# EAGLE schematic Micro controller Board AS-2 (EAGLE 9.6.2)
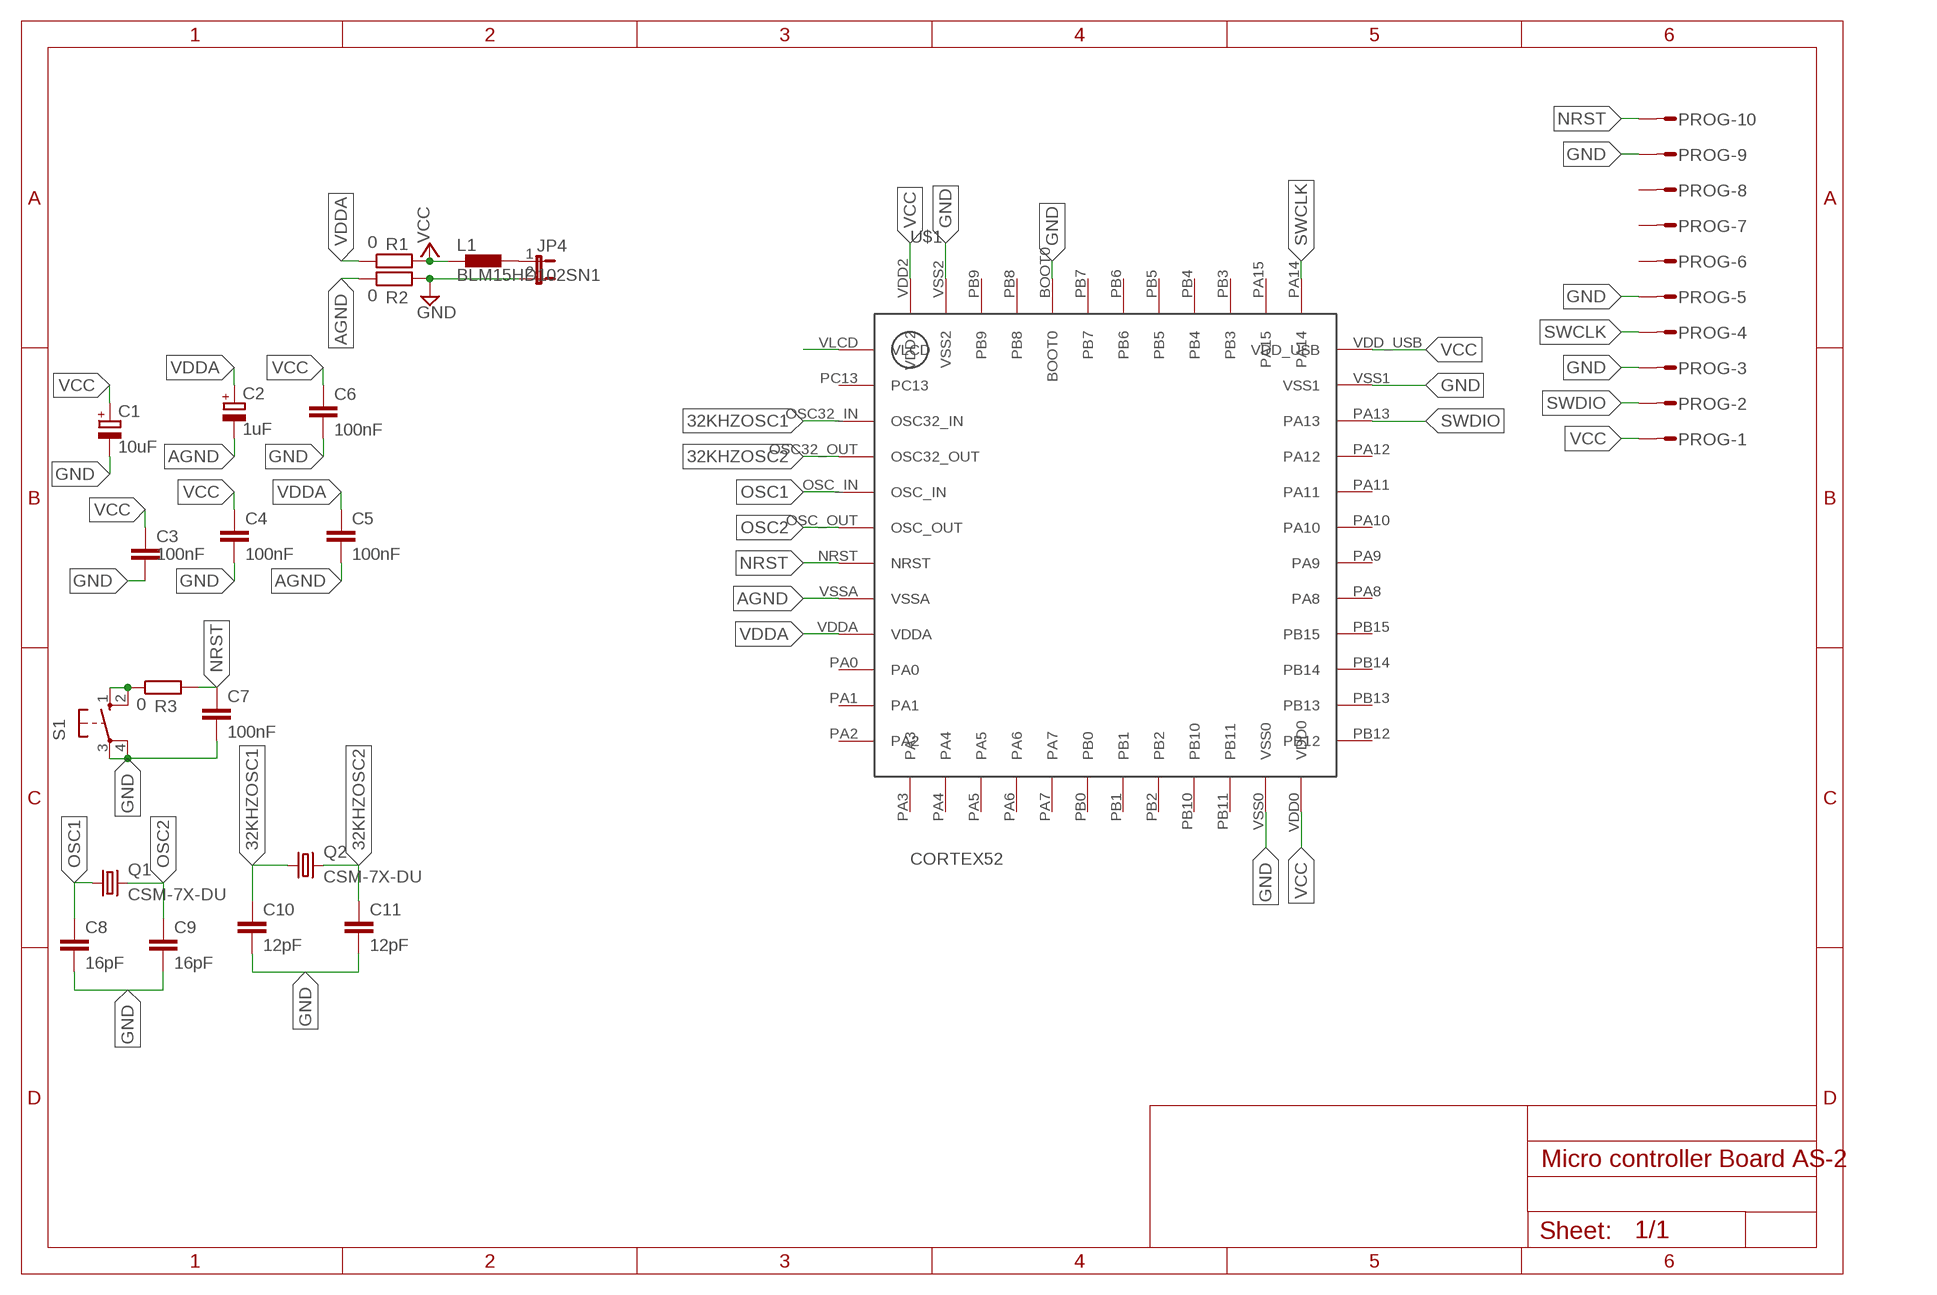
[diagram p0: schematic, sheet 1]

## Parts
C1  10uF  CPOL-EU139CLL-2R  [139CLL-2R]
C2  1uF  CPOL-EU139CLL-2R  [139CLL-2R]
C3  100nF  C-EUC0805  [C0805]
C4  100nF  C-EUC0805  [C0805]
C5  100nF  C-EUC0805  [C0805]
C6  100nF  C-EUC0805  [C0805]
C7  100nF  C-EUC0805  [C0805]
C8  16pF  C-EUC0805  [C0805]
C9  16pF  C-EUC0805  [C0805]
C10  12pF  C-EUC0805  [C0805]
C11  12pF  C-EUC0805  [C0805]
JP4  JP1E  [JP1]
L1  BLM15HD102SN1  [0402]
PROG  S10P  [S10P]
Q1  CSM-7X-DU  [CSM-7X-DU]
Q2  CSM-7X-DU  [CSM-7X-DU]
R1  0  R-EU_R0805  [R0805]
R2  0  R-EU_R0805  [R0805]
R3  0  R-EU_R0805  [R0805]
S1  10-XX  [B3F-10XX]
U$1  CORTEX52  [CORTEX52]

## Nets
32KHZOSC1: C10.1 Q2.1 U$1.OSC32_IN
32KHZOSC2: C11.1 Q2.2 U$1.OSC32_OUT
AGND: C2.- C5.2 R2.1 U$1.VSSA
GND: C1.- C3.2 C4.2 C6.2 C7.2 C8.2 C9.2 C10.2 C11.2 JP4.2 PROG.3 PROG.5 PROG.9 R2.2 S1.3(P) S1.4(P1) U$1.BOOT0 U$1.VSS0 U$1.VSS1 U$1.VSS2
N$1: JP4.1 L1.2
N$2: R3.1 S1.1(S) S1.2(S1)
N$5: U$1.VLCD
NRST: C7.1 PROG.10 R3.2 U$1.NRST
OSC1: C8.1 Q1.1 U$1.OSC_IN
OSC2: C9.1 Q1.2 U$1.OSC_OUT
SWCLK: PROG.4 U$1.PA14
SWDIO: PROG.2 U$1.PA13
VCC: C1.+ C3.1 C4.1 C6.1 L1.1 PROG.1 R1.2 U$1.VDD0 U$1.VDD2 U$1.VDD_USB
VDDA: C2.+ C5.1 R1.1 U$1.VDDA
Unconnected: PROG.6 PROG.7 PROG.8 U$1.PA0 U$1.PA1 U$1.PA2 U$1.PA3 U$1.PA4 U$1.PA5 U$1.PA6 U$1.PA7 U$1.PA8 U$1.PA9 U$1.PA10 U$1.PA11 U$1.PA12 U$1.PA15 U$1.PB0 U$1.PB1 U$1.PB2 U$1.PB3 U$1.PB4 U$1.PB5 U$1.PB6 U$1.PB7 U$1.PB8 U$1.PB9 U$1.PB10 U$1.PB11 U$1.PB12 U$1.PB13 U$1.PB14 U$1.PB15 U$1.PC13

## Library data of the parts
C1 C2 = rcl:CPOL-EU: POLARIZED CAPACITOR, European symbol; SPICEPREFIX: C
C3-C11 = rcl:C-EU: CAPACITOR, European symbol; SPICEPREFIX: C
JP4 = jumper:JP1E: JUMPER
L1 = inductors:BLM15H: EMIFIL (R) Chip Ferrite Bead for GHz Noise Source: http://www.murata.com/ Ferrite Bead BLM15H.pdf
PROG = con-amp-mt:S10P: AMP MT CONNECTOR; OC_FARNELL: unknown; OC_NEWARK: unknown
Q1 Q2 = crystal:CSM-7X-DU: SMD CRYSTAL Source: www.ecsxtal.com .. Crystal 3.6864MHz CSM_7X_DU.PDF; OC_FARNELL: unknown; OC_NEWARK: unknown
R1-R3 = rcl:R-EU_: RESISTOR, European symbol; SPICEPREFIX: R
S1 = switch-omron:10-XX: OMRON SWITCH; MPN: B3F-1000; OC_FARNELL: 176432; OC_NEWARK: 36M3542
U$1 = coxtex32:CORTEX52